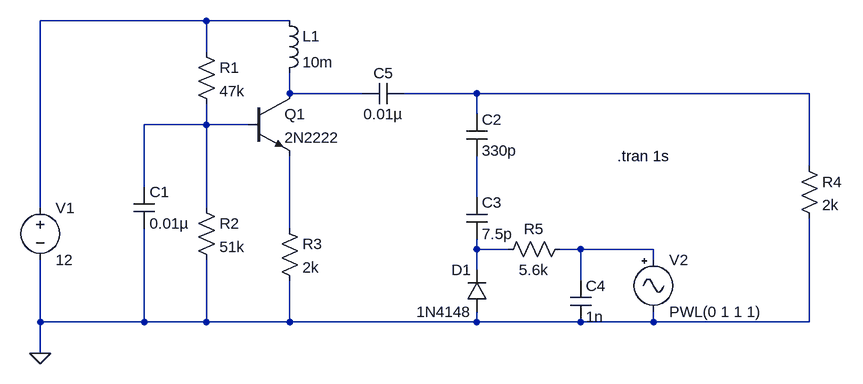
[diagram p0: schematic colpitts adapted.asc]
colpitts adapted.asc, the LTspice schematic file:
Version 4
SHEET 1 1636 680
WIRE 192 -160 -64 -160
WIRE 320 -160 192 -160
WIRE 192 -112 192 -160
WIRE 320 -48 320 -80
WIRE 432 -48 320 -48
WIRE 608 -48 496 -48
WIRE 1120 -48 608 -48
WIRE 608 -16 608 -48
WIRE 192 0 192 -32
WIRE 192 0 96 0
WIRE 256 0 192 0
WIRE 1120 64 1120 -48
WIRE 96 96 96 0
WIRE 608 112 608 48
WIRE -64 128 -64 -160
WIRE 192 128 192 0
WIRE 320 160 320 48
WIRE 608 192 608 176
WIRE 656 192 608 192
WIRE 768 192 736 192
WIRE 880 192 768 192
WIRE 880 208 880 192
WIRE 608 224 608 192
WIRE 768 240 768 192
WIRE -64 304 -64 208
WIRE 96 304 96 160
WIRE 96 304 -64 304
WIRE 192 304 192 208
WIRE 192 304 96 304
WIRE 320 304 320 240
WIRE 320 304 192 304
WIRE 608 304 608 288
WIRE 608 304 320 304
WIRE 768 304 608 304
WIRE 880 304 880 288
WIRE 880 304 768 304
WIRE 1120 304 1120 144
WIRE 1120 304 880 304
WIRE -64 352 -64 304
FLAG -64 352 0
SYMBOL voltage -64 112 R0
WINDOW 123 0 0 Left 0
WINDOW 39 0 0 Left 0
SYMATTR InstName V1
SYMATTR Value 12
SYMBOL cap 80 96 R0
SYMATTR InstName C1
SYMATTR Value 0.01µ
SYMBOL res 176 -128 R0
SYMATTR InstName R1
SYMATTR Value 47k
SYMBOL res 176 112 R0
SYMATTR InstName R2
SYMATTR Value 51k
SYMBOL res 304 144 R0
SYMATTR InstName R3
SYMATTR Value 2k
SYMBOL res 1104 48 R0
SYMATTR InstName R4
SYMATTR Value 2k
SYMBOL cap 592 -16 R0
SYMATTR InstName C2
SYMATTR Value 330p
SYMBOL cap 592 112 R0
SYMATTR InstName C3
SYMATTR Value 7.5p
SYMBOL cap 752 240 R0
SYMATTR InstName C4
SYMATTR Value 1n
SYMBOL res 752 176 R90
WINDOW 0 0 56 VBottom 2
WINDOW 3 32 56 VTop 2
SYMATTR InstName R5
SYMATTR Value 5.6k
SYMBOL cap 496 -64 R90
WINDOW 0 0 32 VBottom 2
WINDOW 3 32 32 VTop 2
SYMATTR InstName C5
SYMATTR Value 0.01µ
SYMBOL ind 304 -176 R0
SYMATTR InstName L1
SYMATTR Value 10m
SYMBOL npn 256 -48 R0
SYMATTR InstName Q1
SYMATTR Value 2N2222
SYMBOL Misc\\signal 880 192 R0
WINDOW 123 0 0 Left 0
WINDOW 39 0 0 Left 0
SYMATTR InstName V2
SYMATTR Value PWL(0 1 1 1)
SYMBOL diode 624 288 R180
WINDOW 0 24 64 Left 2
WINDOW 3 24 0 Left 2
SYMATTR InstName D1
SYMATTR Value 1N4148
SYMATTR Type varactor
TEXT 824 48 Left 2 !.tran 1s

The netlist it stands for:
* colpitts adapted.asc
V1 N001 0 12
C1 N004 0 0.01µ
R1 N001 N004 47k
R2 N004 0 51k
R3 N006 0 2k
R4 N003 0 2k
C2 N003 N005 330p
C3 N005 N007 7.5p
C4 N008 0 1n
R5 N008 N007 5.6k
C5 N003 N002 0.01µ
L1 N001 N002 10m
Q1 N002 N004 N006 0 2N2222
V2 N008 0 PWL(0 1 1 1)
D1 0 N007 1N4148
.model D D
.lib standard.dio
.model NPN NPN
.model PNP PNP
.lib standard.bjt
.tran 1s
.backanno
.end